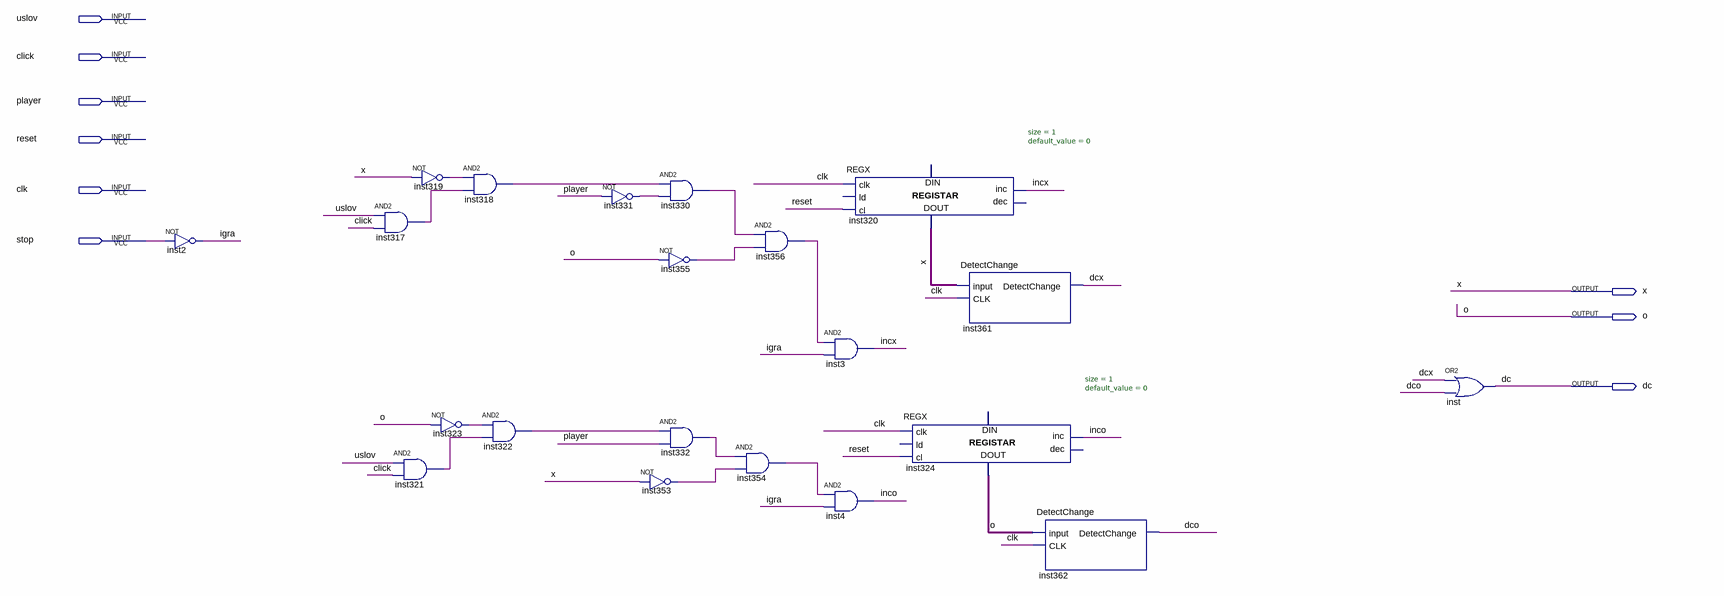
[diagram p0: schematic sheet]
// Quartus schematic XOPolje.bdf as structural Verilog: 21 symbols, 9 pins
module XOPolje (
  input  uslov,
  input  click,
  input  player,
  input  reset,
  input  clk,
  input  stop,
  output x,
  output o,
  output dc
);

  wire dco, dcx, igra, inco, incx, inst317_out, inst318_out, inst319_out, inst321_out, inst322_out,
       inst323_out, inst330_out, inst331_out, inst332_out, inst353_out, inst354_out, inst355_out, inst356_out;

  not inst2 (igra, stop);
  not inst319 (inst319_out, x);
  and inst317 (inst317_out, uslov, click);
  and inst321 (inst321_out, uslov, click);
  and inst318 (inst318_out, inst319_out, inst317_out);
  not inst323 (inst323_out, o);
  and inst322 (inst322_out, inst323_out, inst321_out);
  not inst331 (inst331_out, player);
  and inst330 (inst330_out, inst318_out, inst331_out);
  not inst355 (inst355_out, o);
  and inst332 (inst332_out, inst322_out, player);
  not inst353 (inst353_out, x);
  and inst356 (inst356_out, inst330_out, inst355_out);
  and inst354 (inst354_out, inst332_out, inst353_out);
  and inst3 (incx, inst356_out, igra);
  and inst4 (inco, inst354_out, igra);
  REGX #(.size(1), .default_value(0)) inst320 (
    .clk(clk), .cl(reset), .inc(incx), .data_out(x));  // open: ld, dec, data_in
  REGX #(.size(1), .default_value(0)) inst324 (
    .clk(clk), .cl(reset), .inc(inco), .data_out(o));  // open: ld, dec, data_in
  DetectChange inst361 (.\input (x), .CLK(clk), .DetectChange(dcx));
  DetectChange inst362 (.\input (o), .CLK(clk), .DetectChange(dco));
  or inst (dc, dcx, dco);
endmodule
